# EAGLE design C1_Interface (EAGLE 6.4)
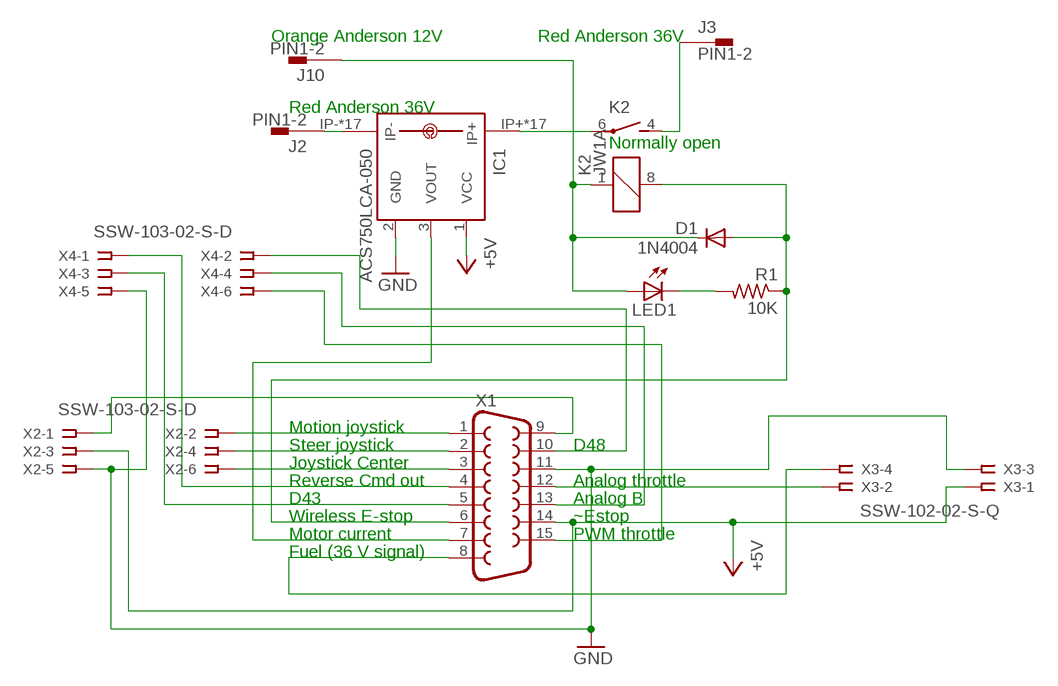
[diagram p0: schematic, sheet 1]

## Parts
D1  1N4004  [DO41-10]
IC1  ACS750LCA-050  [ACS75050]
J2  PIN1-2  [62221]
J3  PIN1-2  [62221]
J10  PIN1-2  [62221]
K2  JW1A  [JW1A]
LED1  LED3MM  [LED3MM]
R1  10K  R-US_0204/5  [0204/5]
X1  F15H  [F15H]
X2  SSW-103-02-S-D  [SSW-103-02-S-D]
X3  SSW-102-02-S-Q  [SSW-102-02-S-Q]
X4  SSW-103-02-S-D  [SSW-103-02-S-D]

## Nets
+5V: IC1.1(VCC) X1.14 X2.3 X3.1
GND: IC1.2(GND) X1.11 X2.5 X3.3 X4.5
N$1: D1.C J10.1 K2.1 LED1.A
N$2: X1.4 X4.1
N$3: IC1.3(VOUT) X1.7
N$4: LED1.K(C) R1.2
N$5: X1.8 X3.4
N$6: J3.1 K2.4(1:S)
N$7: X1.10 X4.2
N$8: X1.5 X4.3
N$9: X1.13 X4.4
N$10: D1.A K2.8 R1.1 X1.6
N$11: X1.1 X2.2
N$12: IC1.IP- IC1.IP-@2(IP-) IC1.IP-@3(IP-) IC1.IP-@4(IP-) IC1.IP-@5(IP-) IC1.IP-@6(IP-) IC1.IP-@7(IP-) IC1.IP-@8(IP-) IC1.IP-@9(IP-) IC1.IP-@10(IP-) IC1.IP-@11(IP-) IC1.IP-@12(IP-) IC1.IP-@13(IP-) IC1.IP-@14(IP-) IC1.IP-@15(IP-) IC1.IP-@16(IP-) IC1.IP-@17(IP-) J2.1
N$13: X1.2 X2.4
N$14: X1.3 X2.6
N$15: X1.9 X2.1
N$17: X1.12 X3.2
N$18: X1.15 X4.6
N$20: IC1.IP+ IC1.IP+@2(IP+) IC1.IP+@3(IP+) IC1.IP+@4(IP+) IC1.IP+@5(IP+) IC1.IP+@6(IP+) IC1.IP+@7(IP+) IC1.IP+@8(IP+) IC1.IP+@9(IP+) IC1.IP+@10(IP+) IC1.IP+@11(IP+) IC1.IP+@12(IP+) IC1.IP+@13(IP+) IC1.IP+@14(IP+) IC1.IP+@15(IP+) IC1.IP+@16(IP+) IC1.IP+@17(IP+) K2.6(1:P)

## Notes on the sheet
- Orange Anderson 12V | Red Anderson 36V
- Red Anderson 36V
- Normally open
- Motion joystick
- Steer joystick | D48
- Joystick Center
- Reverse Cmd out | Analog throttle
- D43 | Analog B
- Wireless E-stop | ~Estop
- Motor current | PWM throttle
- Fuel (36 V signal)

## Library data of the parts
D1 = diode:1N4004: DIODE general purpose rectifier, 1 A
IC1 = allegro:ACS750*CA-050: Current Sensor display layer 49 Reference in BRD and place VIAs on circles Source: www.allegromicro.com/datafile/0750-050.pdf; MF: ALLEGRO MICROSYSTEMS, INC.; MPN: ACS750LCA-050; OC_FARNELL: 1457176; OC_NEWARK: 61H4464
J2 J3 J10 = con-faston:PIN1-2: CONN TAB FASTON BRASS .187 PCB TAB, FSSTON, DUAL STAKE, .187 SERIES Digi-Key Part Number: A24734CT-ND Source: Tyco Electronics Corporation .. ENG_CD_62221_R.pdf http://search.digikey.com/scripts/DkSearch/dksus.dll?Detail&name=A24734CT-ND; MF: TYCO ELECTRONICS; MPN: 62221-1; OC_FARNELL: unknown; OC_NEWARK: 16H2318
K2 = relay:JW1A: Power relay Source: Panasonic Electric Works Co., Ltd. / jw.catalog.pdf
LED1 = led:LED: LED OSRAM: - CHIPLED LG R971, LG N971, LY N971, LG Q971, LY Q971, LO R971, LY R971 LH N974, LH R974 LS Q976, LO Q976, LY Q976 LO Q996 - Hyper CHIPLED LW Q18S LB Q993, LB Q99A, LB R99A - SideLED LS A670, LO A670, LY A670, LG A670, LP A670 LB A673, LV A673, LT A673, LW A673 LH A674 LY A675 LS A676, LA A676, LO A676, LY A676, LW A676 LS A679, LY A679, LG A679 - Hyper Micro SIDELED® LS Y876, LA Y876, LO Y876, LY Y876 LT Y87S - SmartLED LW L88C, LW L88S LB L89C, LB L89S, LG L890 LS L89K, LO L89K, LY L89K LS L896, LA L896, LO L896, LY L896 - TOPLED LS T670, LO T670, LY T670, LG T670, LP T670 LSG T670, LSP T670, LSY T670, LOP T670, LYG T670 LG T671, LOG T671, LSG T671 LB T673, LV T673, LT T673, LW T673 LH T674 LS T676, LA T676, LO T676, LY T676, LB T676, LH T676, LSB T676, LW T676 LB T67C, LV T67C, LT T67C, LS T67K, LO T67K, LY T67K, LW E67C LS E67B, LA E67B, LO E67B, LY E67B, LB E67C, LV E67C, LT E67C LW T67C LS T679, LY T679, LG T679 LS T770, LO T770, LY T770, LG T770, LP T770 LB T773, LV T773, LT T773, LW T773 LH T774 LS E675, LA E675, LY E675, LS T675 LS T776, LA T776, LO T776, LY T776, LB T776 LHGB T686 LT T68C, LB T68C - Hyper Mini TOPLED® LB M676 - Mini TOPLED Santana® LG M470 LS M47K, LO M47K, LY M47K Source: http://www.osram.convergy.de LUXEON: - LUMILED® LXK2-PW12-R00, LXK2-PW12-S00, LXK2-PW14-U00, LXK2-PW14-V00 LXK2-PM12-R00, LXK2-PM12-S00, LXK2-PM14-U00 LXK2-PE12-Q00, LXK2-PE12-R00, LXK2-PE12-S00, LXK2-PE14-T00, LXK2-PE14-U00 LXK2-PB12-K00, LXK2-PB12-L00, LXK2-PB12-M00, LXK2-PB14-N00, LXK2-PB14-P00, LXK2-PB14-Q00 LXK2-PR12-L00, LXK2-PR12-M00, LXK2-PR14-Q00, LXK2-PR14-R00 LXK2-PD12-Q00, LXK2-PD12-R00, LXK2-PD12-S00 LXK2-PH12-R00, LXK2-PH12-S00 LXK2-PL12-P00, LXK2-PL12-Q00, LXK2-PL12-R00 Source: www.luxeon.com KINGBRIGHT: KA-3528ASYC Source: www.kingbright.com
R1 = rcl:R-US_: RESISTOR, American symbol
X1 = con-subd:F15: SUB-D; OC_FARNELL: unknown; OC_NEWARK: unknown
X2 X4 = con-samtec:SSW-103-02-S-D: THROUGH-HOLE .025" SQ POST SOCKET Source: Samtec SSW.pdf; MPN: SSW-103-02-S-D; OC_FARNELL: unknown; OC_NEWARK: 11P9365
X3 = con-samtec:SSW-102-02-S-Q: THROUGH-HOLE .025" SQ POST SOCKET Source: Samtec SSW.pdf; MPN: SSW-102-02-S-Q; OC_FARNELL: unknown; OC_NEWARK: 82P1706

## Board
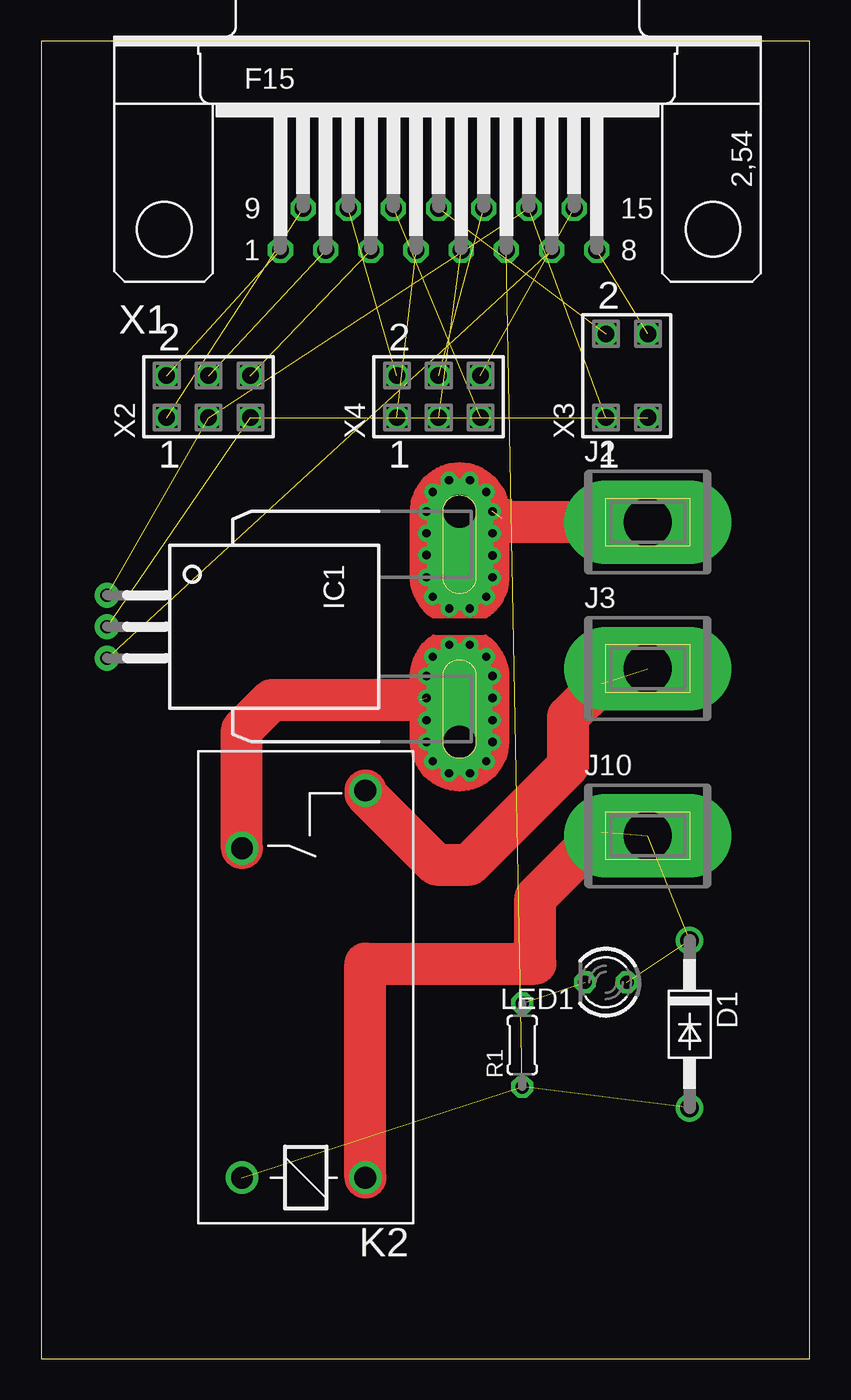
[diagram p1: board, top side]
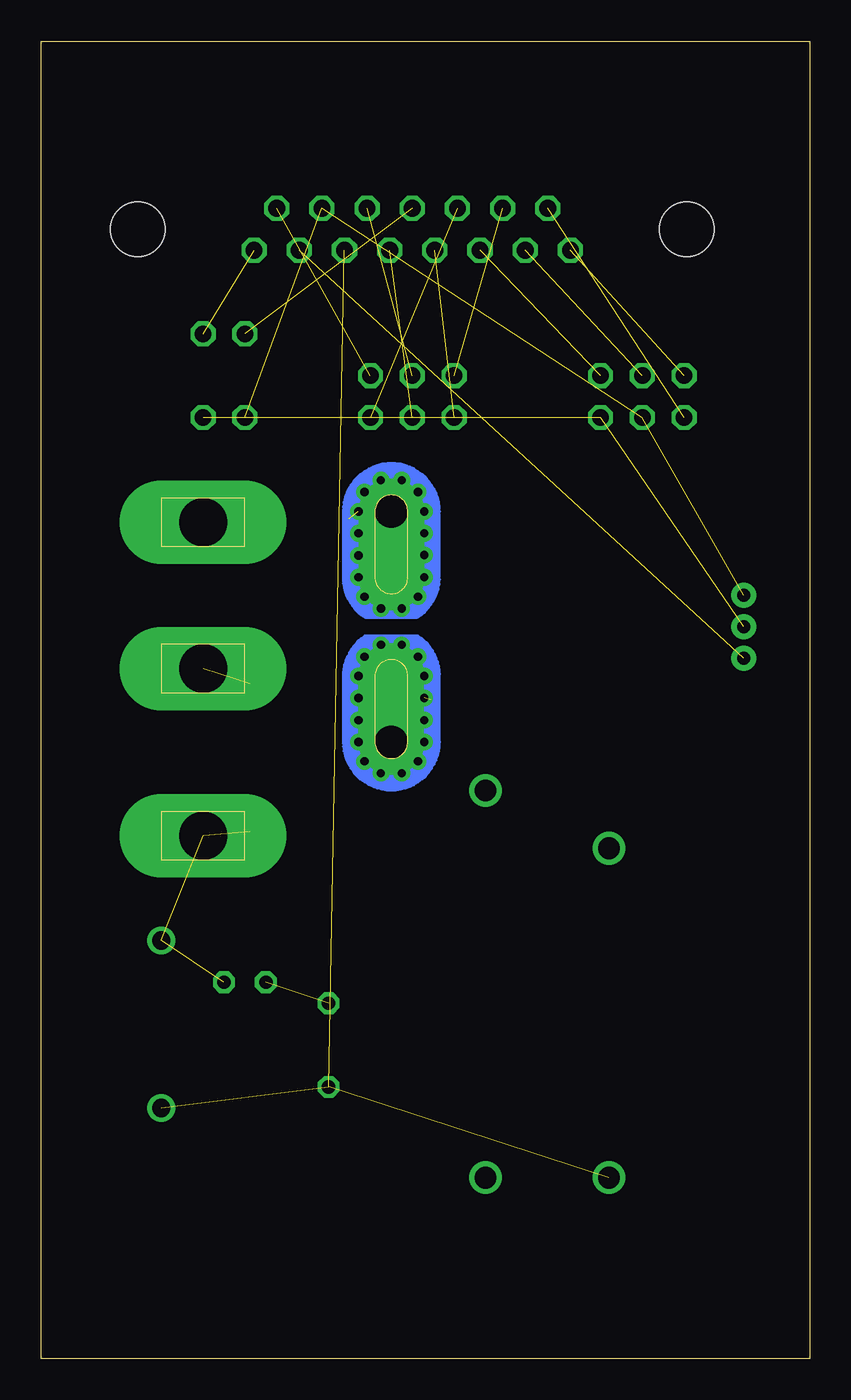
[diagram p2: board, bottom side, seen from below]

Size 46.66 x 80 mm. Coordinates in mm from the lower left corner, seen from the top.
Outline: 0,0 46.66,0 46.66,80 0,80 0,0
Copper layers (1*16): Top 0.035mm / dielectric 1.5mm / Bottom 0.035mm
Design rules "default": minimum track width 10mil, minimum drill 24mil, track to track 8mil, track to pad 8mil, pad to pad 8mil, via to via 8mil, smd to smd 8mil, copper to edge 40mil, drill to drill 8mil, minimum pad ring 10mil, minimum via ring 8mil, stop-mask expansion 4mil, vias tented up to drill 0mil, thermal gap 10mil

### Footprints (pad centres in the part's own frame; a part is rotated, then mirrored left to right if it is on the bottom)
DO41-10 = drill 1.118: A 5.08,0; C -5.08,0
ACS75050 = drill 0.8 pad 1.5: 1 -1.91,-21.4; 2 0,-21.4; 3 1.91,-21.4 | drill 2 pad 4 offset: IP+ 7,0; IP- -7,0 | drill 0.5 pad 0.9: IP+@2 8.89,-0.635; IP+@3 8.89,0.635; IP+@4 8.175,1.625; IP+@5 7,2; IP+@6 5.675,2; IP+@7 4.325,2; IP+@8 3,2; IP+@9 1.825,1.625; IP+@10 1.1,0.625; IP+@11 1.1,-0.625; IP+@12 1.825,-1.625; IP+@13 3,-2; IP+@14 4.325,-2; IP+@15 5.675,-2; IP+@16 7,-2; IP+@17 8.175,-1.625; IP-@2 -8.89,-0.635; IP-@3 -8.89,0.635; IP-@4 -8.175,1.625; IP-@5 -7,2; IP-@6 -5.675,2; IP-@7 -4.325,2; IP-@8 -3,2; IP-@9 -1.825,1.625; IP-@10 -1.1,0.625; IP-@11 -1.1,-0.625; IP-@12 -1.825,-1.625; IP-@13 -3,-2; IP-@14 -4.35,-2; IP-@15 -5.675,-2; IP-@16 -7,-2; IP-@17 -8.175,-1.625
62221 = drill 2.921 pad 5.08 long: 1 0,0
JW1A = drill 1.321 pad 1.9: 1 -10,-3.683; 4 13.5,-3.683; 6 10,3.81; 8 -10,3.81
LED3MM = drill 0.813 octagon: A -1.27,0; K 1.27,0
0204/5 = drill 0.813 octagon: 1 -2.54,0; 2 2.54,0
F15H = drill 1.016 octagon: 1 -9.601,-1.27; 2 -6.858,-1.27; 3 -4.115,-1.27; 4 -1.372,-1.27; 5 1.372,-1.27; 6 4.115,-1.27; 7 6.858,-1.27; 8 9.601,-1.27; 9 -8.23,1.27; 10 -5.486,1.27; 11 -2.743,1.27; 12 0,1.27; 13 2.743,1.27; 14 5.486,1.27; 15 8.23,1.27 | hole 3.302: -16.662,0; 16.662,0
SSW-103-02-S-D = drill 1 pad 1.5 octagon: 1 -2.54,-1.27; 2 -2.54,1.27; 3 0,-1.27; 4 0,1.27; 5 2.54,-1.27; 6 2.54,1.27
SSW-102-02-S-Q = drill 1 pad 1.5 octagon: 1 -1.27,-2.54; 2 -1.27,2.54; 3 1.27,-2.54; 4 1.27,2.54

### Placement (x,y rotation side)
D1  39.37,20.32 270 top
IC1  25.4,44.45 270 top
J2  36.83,50.8 0 top
J3  36.83,41.91 0 top
J10  36.83,31.75 0 top
K2  16,21 90 top
LED1  34.29,22.86 180 top
R1  29.21,19.05 90 top
X1  24.13,68.58 0 top
X2  10.16,58.42 0 top
X3  35.56,59.69 0 top
X4  24.13,58.42 0 top

### Tracks (layer width: path | path; a pad name or v marks a point on that pad's centre or on a via)
+5V  (3 unrouted)
GND  (4 unrouted)
N$1  (3 unrouted)
  Top 2.54: K2.1 19.68,24 30,24 30,28 34,32
N$2  (1 unrouted)
N$3  (1 unrouted)
N$4  (1 unrouted)
N$5  (1 unrouted)
N$6  (1 unrouted)
  Top 2.54: K2.4 19.68,34.32 24,30 26,30 32,36 32,39 34,41
N$7  (1 unrouted)
N$8  (1 unrouted)
N$9  (1 unrouted)
N$10  (3 unrouted)
N$11  (1 unrouted)
N$12  (1 unrouted)
  Top 2.54: J2.1 28.2,50.8 28,51
N$13  (1 unrouted)
N$14  (1 unrouted)
N$15  (1 unrouted)
N$17  (1 unrouted)
N$18  (1 unrouted)
N$20  (1 unrouted)
  Top 2.54: K2.6 12.19,38.19 14,40 23,40